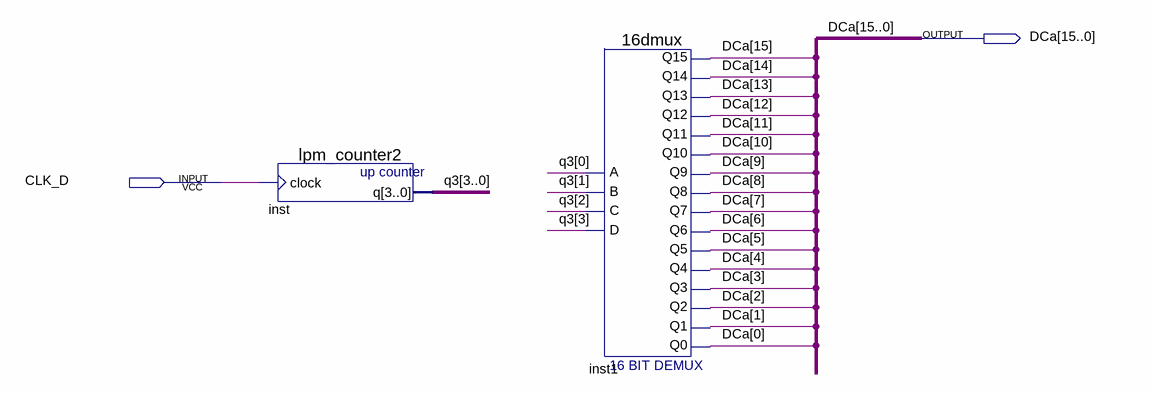
[diagram p0: schematic sheet]
// Quartus schematic Block_3.bdf as structural Verilog: 2 symbols, 2 pins
module Block_3 (
  input  CLK_D,
  output [15:0] DCa
);

  wire [3:0] q3;

  lpm_counter2 inst (.clock(CLK_D), .q(q3));
  \16dmux  inst1 (
    .C(q3[2]), .B(q3[1]), .A(q3[0]), .D(q3[3]), .Q12(DCa[12]), .Q13(DCa[13]), .Q11(DCa[11]), .Q9(DCa[9]),
    .Q10(DCa[10]), .Q7(DCa[7]), .Q8(DCa[8]), .Q4(DCa[4]), .Q5(DCa[5]), .Q6(DCa[6]), .Q2(DCa[2]), .Q3(DCa[3]),
    .Q14(DCa[14]), .Q15(DCa[15]), .Q0(DCa[0]), .Q1(DCa[1]));
endmodule
